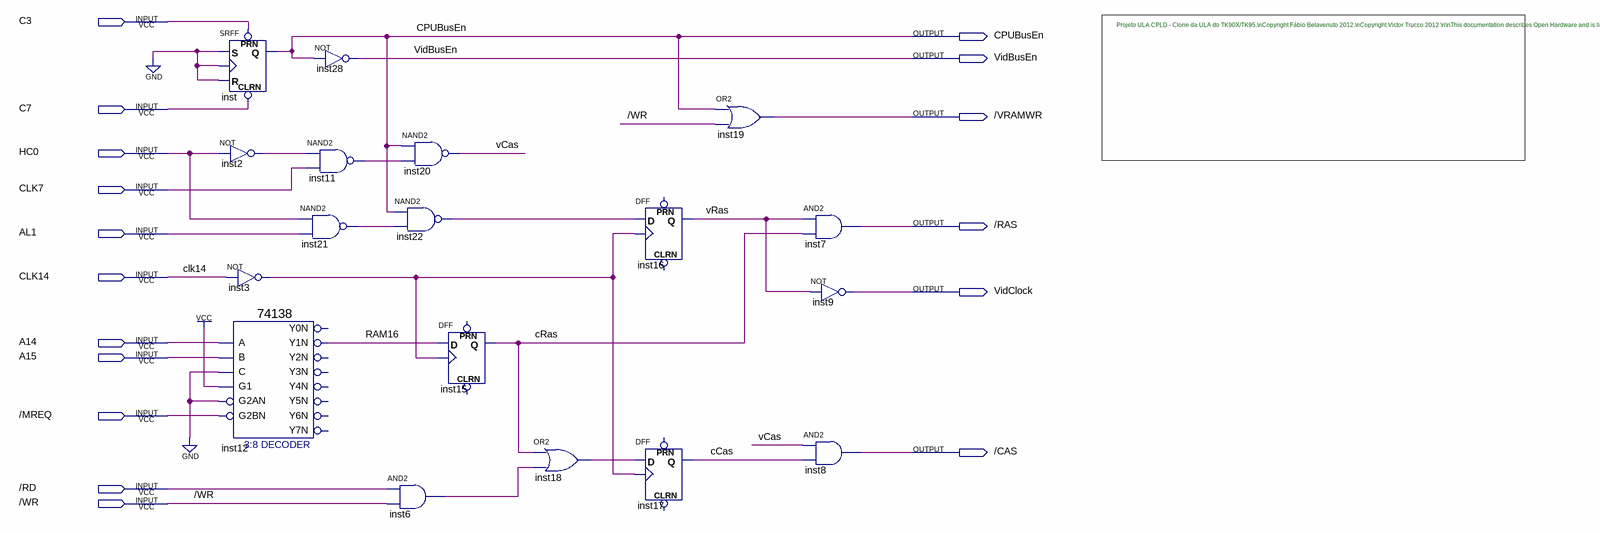
[diagram p0: schematic sheet]
// Quartus schematic DRAM_CAS_RAS.bdf as structural Verilog: 18 symbols, 17 pins
module DRAM_CAS_RAS (
  input  C3,
  input  C7,
  input  HC0,
  input  CLK7,
  input  AL1,
  input  CLK14,
  input  A14,
  input  A15,
  input  \/MREQ ,
  input  \/RD ,
  input  \/WR ,
  output CPUBusEn,
  output VidBusEn,
  output \/VRAMWR ,
  output \/RAS ,
  output VidClock,
  output \/CAS 
);

  wire cCas, cRas, inst2_out, inst3_out, inst6_out, inst11_out, inst18_out, inst21_out, inst22_out, RAM16,
       vCas, vRas;

  SRFF inst (.PRN(C3), .CLRN(C7), .S(1'b0), .R(1'b0), .CLK(1'b0), .Q(CPUBusEn));
  not inst2 (inst2_out, HC0);
  not inst3 (inst3_out, CLK14);
  \74138  inst12 (
    .A(A14), .B(A15), .G1(1'b1), .C(1'b0), .G2AN(1'b0), .G2BN(\/MREQ ), .Y1N(RAM16));  // open: Y0N, Y2N, Y3N, Y4N, Y5N, Y6N, Y7N
  not inst28 (VidBusEn, CPUBusEn);
  nand inst11 (inst11_out, inst2_out, CLK7);
  nand inst21 (inst21_out, HC0, AL1);
  nand inst20 (vCas, CPUBusEn, inst11_out);
  nand inst22 (inst22_out, CPUBusEn, inst21_out);
  DFF inst15 (.CLK(inst3_out), .D(RAM16), .Q(cRas));  // open: CLRN, PRN
  and inst6 (inst6_out, \/RD , \/WR );
  or inst18 (inst18_out, cRas, inst6_out);
  DFF inst16 (.CLK(inst3_out), .D(inst22_out), .Q(vRas));  // open: CLRN, PRN
  DFF inst17 (.CLK(inst3_out), .D(inst18_out), .Q(cCas));  // open: CLRN, PRN
  or inst19 (\/VRAMWR , CPUBusEn, \/WR );
  and inst7 (\/RAS , vRas, cRas);
  not inst9 (VidClock, vRas);
  and inst8 (\/CAS , vCas, cCas);

  // Notes on the sheet:
  //   Projeto ULA CPLD - Clone da ULA do TK90X/TK95.\nCopyright Fábio Belavenuto 2012.\nCopyright Victor Trucco 2012.\n\nThis documentation describes Open Hardware and is licensed under the CERN OHL v. 1.1.\nYou may redistribute and modify this documentation under the terms of the\nCERN OHL v.1.1. (http://ohwr.org/cernohl). This documentation is distributed\nWITHOUT ANY EXPRESS OR IMPLIED WARRANTY, INCLUDING OF MERCHANTABILITY,\nSATISFACTORY QUALITY AND FITNESS FOR A PARTICULAR PURPOSE.\nPlease see the CERN OHL v.1.1 for applicable conditions
endmodule
